# Altium schematic sheet Neopixel_Interface.SchDoc: Neopixel LED Interface
size A4; DrawnBy: Samyar Sadat Akhavi; Revision: 1.0; SheetNumber: 12; SheetTotal: 14
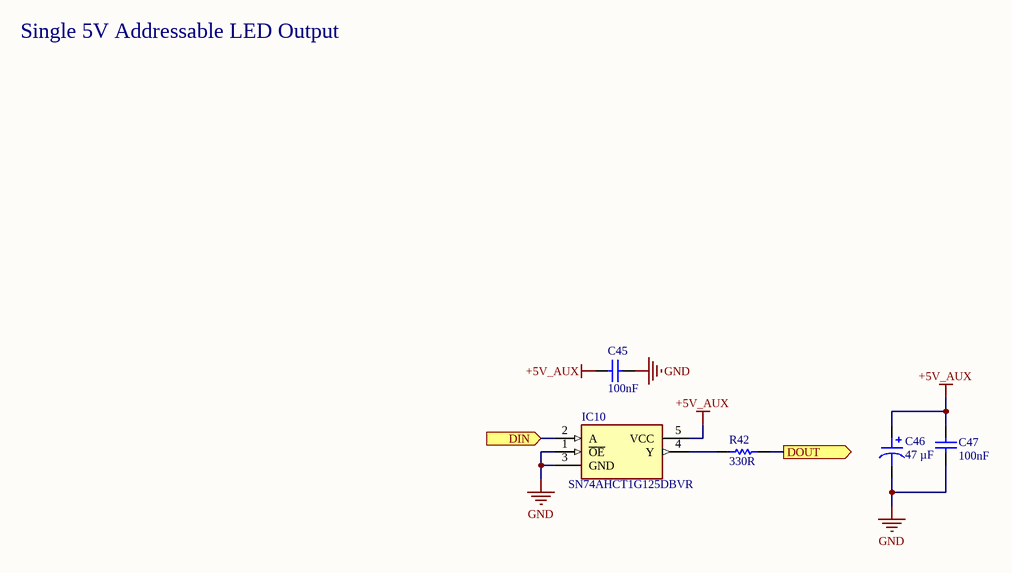
[diagram p0: Neopixel_Interface.SchDoc]

## Parts
?  (no value)  (graphical)
C45  100nF  [CAP_SMD_603]
C46  47 µF  [CAP ALSMD 6.6MM H5.4MM]
C47  100nF  [CAP_SMD_603]
IC10  SN74AHCT1G125DBVR  [SOT95P280X145-5N]
R42  330R  [RES_0603]

## Ports
DIN (in, see Lighting[1B]), DOUT (out, see Lighting[2B])

## Nets
+5V_AUX: C45.2 C46.1 C47.2 IC10.5(VCC)
GND: C45.1 C46.2 C47.1 IC10.1(~{OE}) IC10.3(GND)
DIN: IC10.2(A) ; port DIN
DOUT: R42.1 ; port DOUT
NetIC10_4: IC10.4(Y) R42.2

## Notes on the sheet
- Single 5V Addressable LED Output
- Sub-Project:
- Size:
- Drawn By:
- Revision:
- Date:
- File:
- Sheet:
- of

## Library data of the parts
? = Standard Title Block
C45 C47 = Non-polar Capacitor: Generic Ceramic Capacitor; Voltage: 6.3V; Value: 100nF
C46 = 865080443007: CAP ALUM 47UF 20% 25V SMD; manufacturer: Würth Elektronik; Impedance: 560 mOhms; Lifetime @ Temp.: 2000 Hrs @ 105°C; Polarization: Polar; Ripple Current @ High Frequency: 220 mA @ 100 kHz; Ripple Current @ Low Frequency: 143 mA @ 120 Hz; Surface Mount Land Size: 0.260" L x 0.260" W (6.60mm x 6.60mm); Part Number: 865080443007; Applications: General Purpose; Capacitance: 47 µF; componentlink1description: Datasheet; componentlink1url: https://katalog.we-online.de/pbs/datasheet/865080443007.pdf; componentlink2description: DigiKey Link; componentlink2url: https://www.digikey.com/en/products/detail/würth-elektronik/865080443007/5728030; Device Package: Radial, Can - SMD; Height - Seated (Max): 0.217" (5.50mm); lastupdated: 6/3/2024 7:53:40 PM; Lifecycle Status: Active; Minimum Order: 1; Mounting Type: Surface Mount; Operating Temperature: -55°C ~ 105°C; Package / Case: Radial, Can - SMD; packaging: TapeAndReel; partid: 8980; Part Status: Active; price: 0.15; series: WCAP-ASLI; Size / Dimension: 0.248" Dia (6.30mm); Supplier 1: DigiKey; Supplier Part Number 1: 732-8435-1-ND; Tolerance: ±20%; value: 47 µF; Voltage - Rated: 25 V
IC10 = SN74AHCT1G125DBVR: Integrated Circuit; Manufacturer_Name: Texas Instruments; Datasheet Link: http://www.ti.com/lit/ds/symlink/sn74ahct1g125.pdf; Height: 1.45mm; Manufacturer_Part_Number: SN74AHCT1G125DBVR; Mouser Part Number: 595-SNAHCT1G125DBVR; Mouser Price/Stock: https://www.mouser.co.uk/ProductDetail/Texas-Instruments/SN74AHCT1G125DBVR?qs=N6WZOzgtpqVaVW8Lh%252BgevA%3D%3D; Arrow Part Number: SN74AHCT1G125DBVR; Arrow Price/Stock: https://www.arrow.com/en/products/sn74ahct1g125dbvr/texas-instruments?utm_currency=USD&region=nac
R42 = Resistor: Power: 1/8W; Value: 330R